# Altium schematic sheet BAT_LFK280k.SchDoc
size A2; SheetNumber: 2; SheetTotal: 2
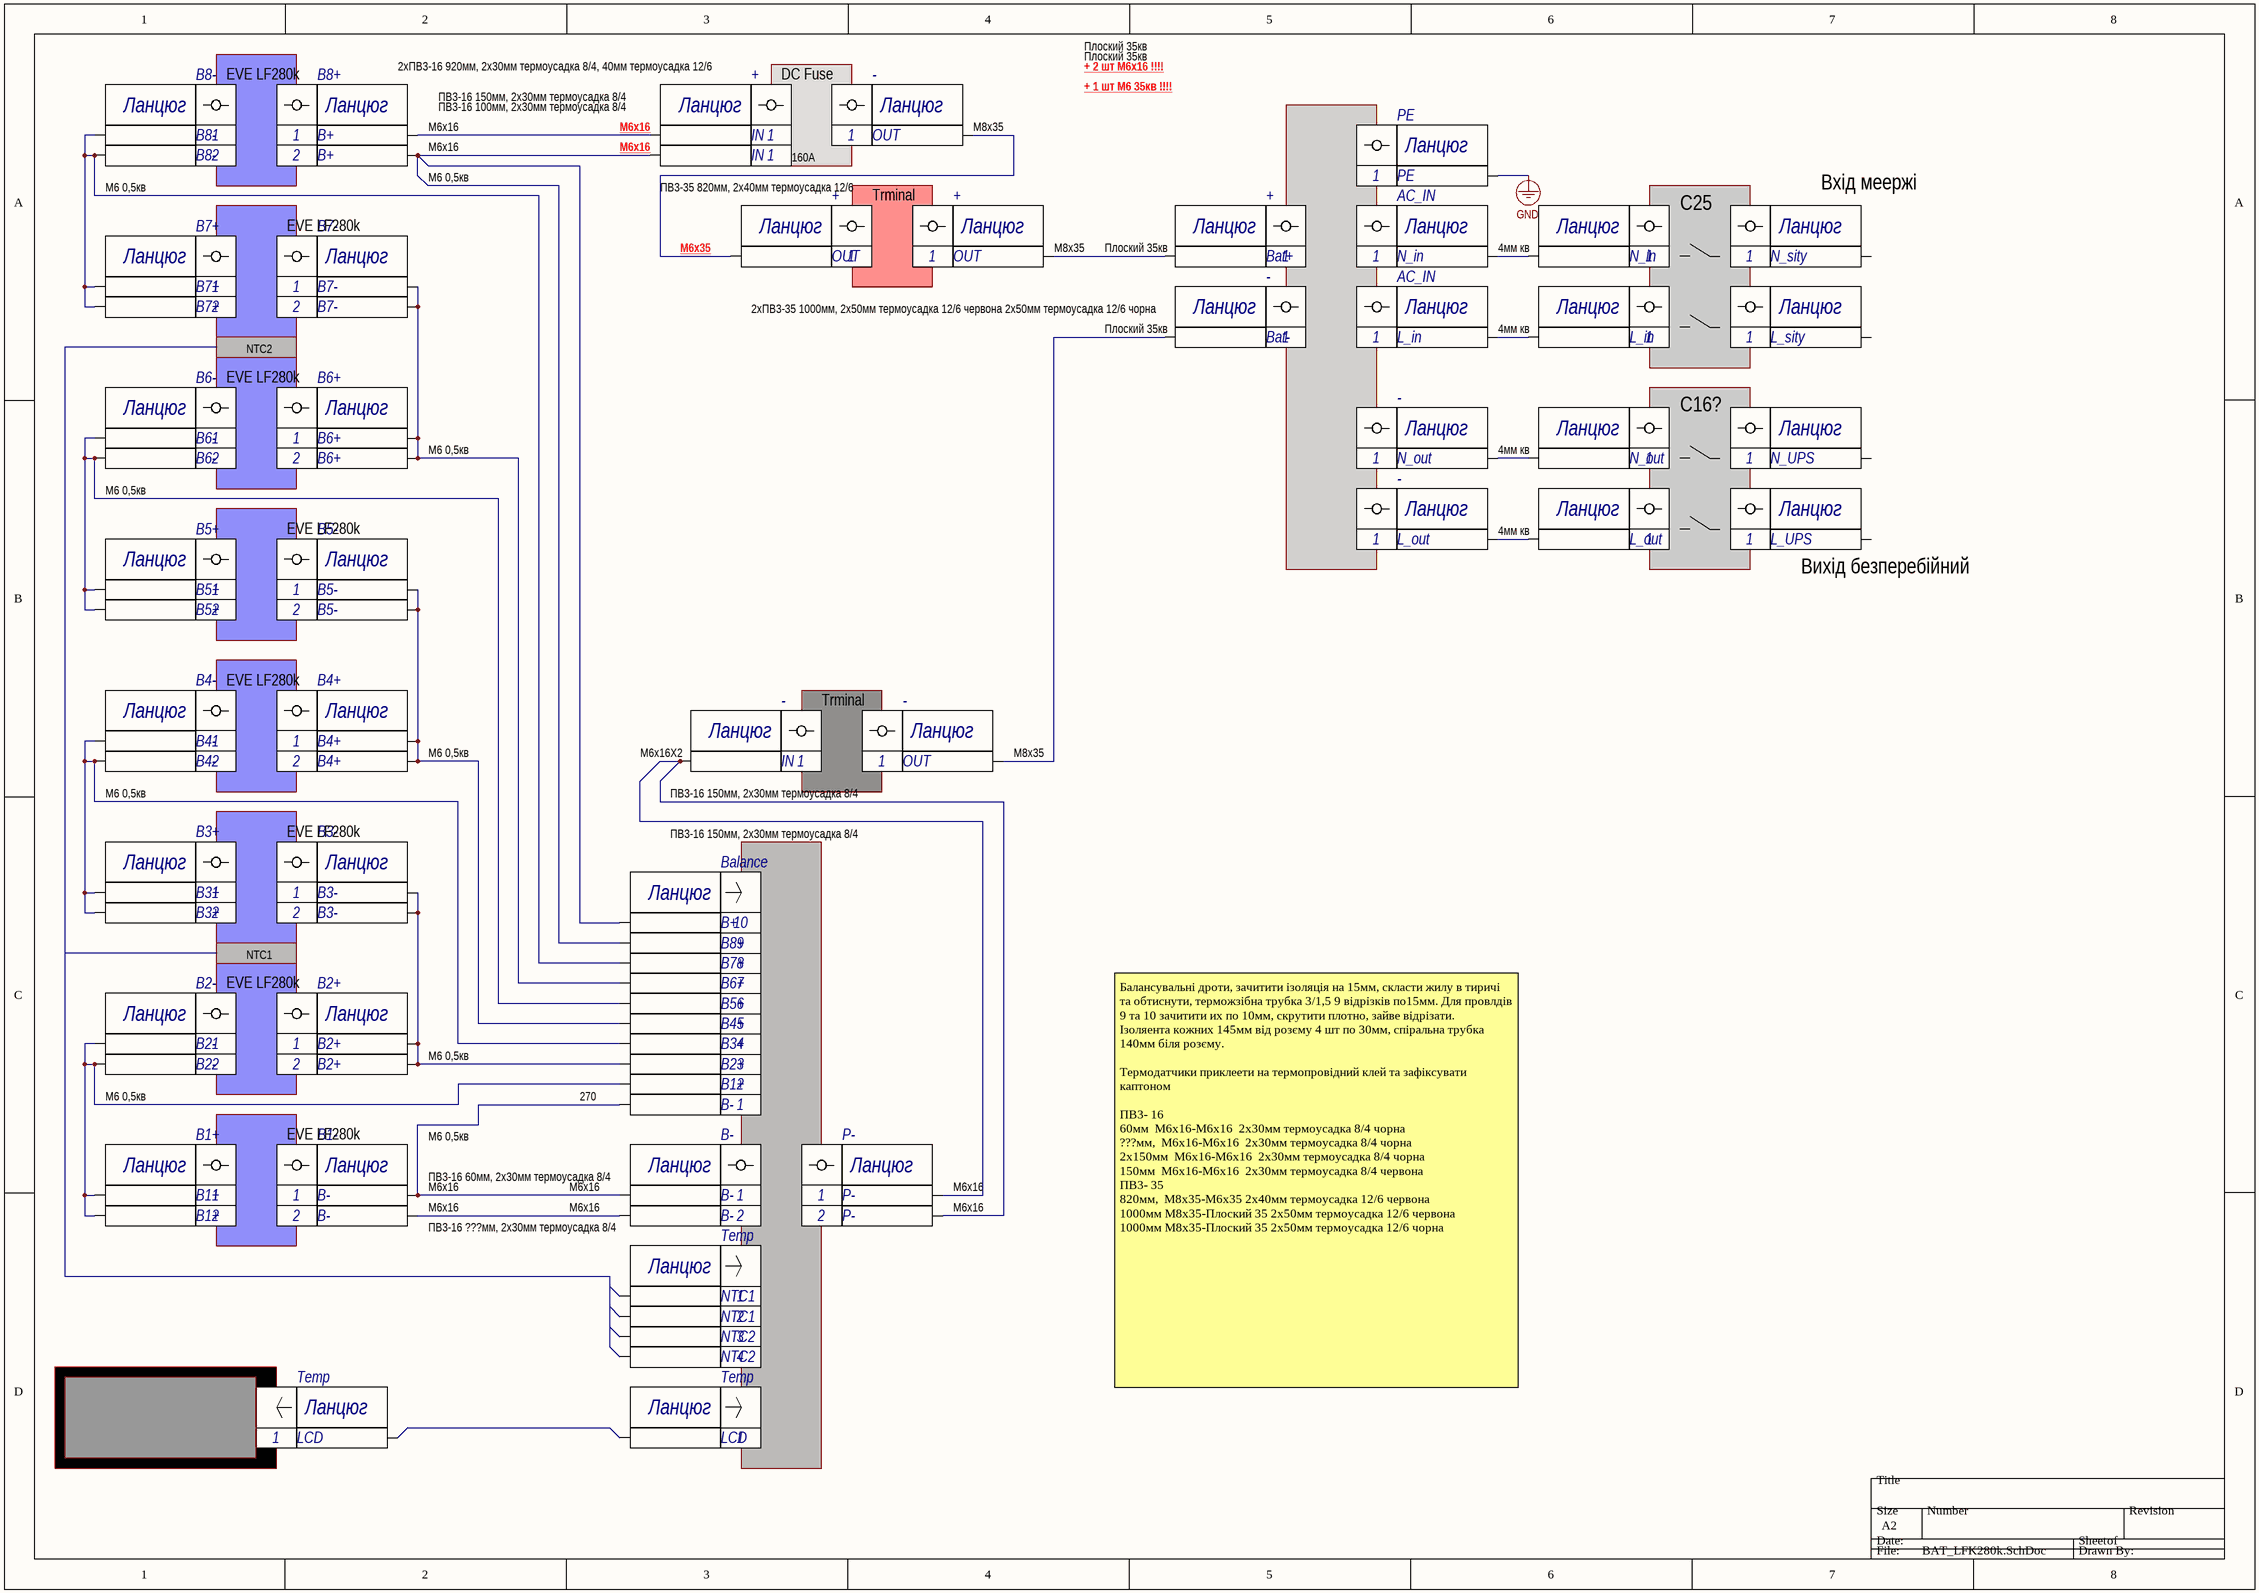
[diagram p0: BAT_LFK280k.SchDoc]

## Parts
(Parts that share a designator on the sheet are numbered #1, #2 ... from top to bottom, then left to right.)
SA?#1  219-2LPS  [219-2LPS]  (value not drawn)  (part A of 2)
SA?#2  219-2LPS  [219-2LPS]  (value not drawn)  (part B of 2)
SA?#3  219-2LPS  [219-2LPS]  (value not drawn)  (part A of 2)
SA?#4  219-2LPS  [219-2LPS]  (value not drawn)  (part B of 2)
ZP?#1  Розєм гвинт Шапка Е4  (value not drawn)
ZP?#2  Розєм гвинт Шапка Е4  (value not drawn)
ZP?#3  Розєм гвинт Шапка Е4  (value not drawn)
ZP?#4  Розєм гвинт Шапка Е4  (value not drawn)
ZP?#5  Розєм Контакт Е4  (value not drawn)
ZP?#6  Розєм Контакт Е4  (value not drawn)
ZP?#7  Розєм Контакт Е4  (value not drawn)
ZP?#8  Розєм Контакт Е4  (value not drawn)
ZP?#9  Розєм Контакт Е4  (value not drawn)
ZP?#10  Розєм Контакт Е4  (value not drawn)
ZP?#11  Розєм Контакт Е4  (value not drawn)
ZP?#12  Розєм гвинт Шапка Е4  (value not drawn)
ZP?#13  Розєм Контакт Е4  (value not drawn)
ZP?#14  Розєм гвинт Шапка Е4  (value not drawn)
ZP?#15  Розєм гвинт Шапка Е4  (value not drawn)
ZP?#16  Розєм гвинт Шапка Е4  (value not drawn)
ZP?#17  Розєм гвинт Шапка Е4  (value not drawn)
ZP?#18  Розєм гвинт Шапка Е4  (value not drawn)
ZP?#19  Розєм гвинт Шапка Е4  (value not drawn)
ZP?#20  Розєм Контакт Е4  (value not drawn)
ZP?#21  Розєм Контакт Е4  (value not drawn)
ZP?#22  Розєм Контакт Е4  (value not drawn)
ZP?#23  Розєм Контакт Е4  (value not drawn)
ZP?#24  Розєм Контакт Е4  (value not drawn)
ZP?#25  Розєм Контакт Е4  (value not drawn)
ZP?#26  Розєм гвинт Шапка Е4  (value not drawn)
ZP?#27  Розєм гвинт Шапка Е4  (value not drawn)
ZP?#28  Розєм Контакт Е4  (value not drawn)
ZP?#29  Розєм Контакт Е4  (value not drawn)
ZP?#30  Розєм Контакт Е4  (value not drawn)
ZP?#31  Розєм Контакт Е4  (value not drawn)
ZP?#32  Розєм гвинт Шапка Е4  (value not drawn)
ZP?#33  Розєм гвинт Шапка Е4  (value not drawn)
ZP?#34  Розєм гвинт Шапка Е4  (value not drawn)
ZP?#35  Розєм гвинт Шапка Е4  (value not drawn)
ZP?#36  Розєм Контакт Е4  (value not drawn)
ZP?#37  Розєм Контакт Е4  (value not drawn)
ZP?#38  Розєм Контакт Е4  (value not drawn)
ZP?#39  Розєм Контакт Е4  (value not drawn)
ZP?#40  Розєм гвинт Шапка Е4  (value not drawn)
ZP?#41  Розєм гвинт Шапка Е4  (value not drawn)
ZP?#42  Розєм Контакт Е4  (value not drawn)
ZP?#43  Розєм Контакт Е4  (value not drawn)
ZP?#44  Розєм гвинт Шапка Е4  (value not drawn)
ZP?#45  Розєм гвинт Шапка Е4  (value not drawn)
ZP?#46  Розєм гвинт Шапка Е4  (value not drawn)
ZP?#47  Розєм Контакт Е4  (value not drawn)
ZP?#48  Розєм Контакт Е4  (value not drawn)
ZP?#49  Розєм Контакт Е4  (value not drawn)
ZP?#50  Розєм Контакт Е4  (value not drawn)
ZP?#51  Розєм Контакт Е4  (value not drawn)
ZP?#52  Розєм гвинт Шапка Е4  (value not drawn)
ZP?#53  Розєм гвинт Шапка Е4  (value not drawn)
ZP?#54  Розєм гвинт Шапка Е4  (value not drawn)
ZP?#55  Розєм Контакт Е4  (value not drawn)
ZP?#56  Розєм Контакт Е4  (value not drawn)
ZP?#57  Розєм Контакт Е4  (value not drawn)
ZP?#58  Розєм гвинт Шапка Е4  (value not drawn)
ZP?#59  Розєм гвинт Шапка Е4  (value not drawn)
ZP?#60  Розєм Контакт Е4  (value not drawn)
ZP?#61  Розєм Контакт Е4  (value not drawn)
ZP?#62  Розєм Контакт Е4  (value not drawn)
ZP?#63  Розєм Контакт Е4  (value not drawn)
ZP?#64  Розєм гвинт Шапка Е4  (value not drawn)
ZP?#65  Розєм гвинт Шапка Е4  (value not drawn)
ZP?#66  Розєм Контакт Е4  (value not drawn)
ZP?#67  Розєм Контакт Е4  (value not drawn)
ZP?#68  Розєм гвинт Шапка Е4  (value not drawn)
ZP?#69  Розєм гвинт Шапка Е4  (value not drawn)
ZP?#70  Розєм Контакт Е4  (value not drawn)
ZP?#71  Розєм Контакт Е4  (value not drawn)
ZP?#72  Розєм Контакт Е4  (value not drawn)
ZP?#73  Розєм Контакт Е4  (value not drawn)
ZP?#74  Розєм гвинт Шапка Е4  (value not drawn)
ZP?#75  Розєм гвинт Шапка Е4  (value not drawn)
ZP?#76  Розєм Контакт Е4  (value not drawn)
ZP?#77  Розєм Контакт Е4  (value not drawn)
ZP?#78  Розєм папа Шапка Е4  (value not drawn)
ZP?#79  Розєм Контакт Е4  (value not drawn)
ZP?#80  Розєм Контакт Е4  (value not drawn)
ZP?#81  Розєм Контакт Е4  (value not drawn)
ZP?#82  Розєм Контакт Е4  (value not drawn)
ZP?#83  Розєм Контакт Е4  (value not drawn)
ZP?#84  Розєм Контакт Е4  (value not drawn)
ZP?#85  Розєм Контакт Е4  (value not drawn)
ZP?#86  Розєм гвинт Шапка Е4  (value not drawn)
ZP?#87  Розєм гвинт Шапка Е4  (value not drawn)
ZP?#88  Розєм Контакт Е4  (value not drawn)
ZP?#89  Розєм Контакт Е4  (value not drawn)
ZP?#90  Розєм Контакт Е4  (value not drawn)
ZP?#91  Розєм Контакт Е4  (value not drawn)
ZP?#92  Розєм Контакт Е4  (value not drawn)
ZP?#93  Розєм Контакт Е4  (value not drawn)
ZP?#94  Розєм Контакт Е4  (value not drawn)
ZP?#95  Розєм Контакт Е4  (value not drawn)
ZP?#96  Розєм Контакт Е4  (value not drawn)
ZP?#97  Розєм гвинт Шапка Е4  (value not drawn)
ZP?#98  Розєм гвинт Шапка Е4  (value not drawn)
ZP?#99  Розєм гвинт Шапка Е4  (value not drawn)
ZP?#100  Розєм гвинт Шапка Е4  (value not drawn)
ZP?#101  Розєм Контакт Е4  (value not drawn)
ZP?#102  Розєм Контакт Е4  (value not drawn)
ZP?#103  Розєм Контакт Е4  (value not drawn)
ZP?#104  Розєм Контакт Е4  (value not drawn)
ZP?#105  Розєм Контакт Е4  (value not drawn)
ZP?#106  Розєм Контакт Е4  (value not drawn)
ZP?#107  Розєм Контакт Е4  (value not drawn)
ZP?#108  Розєм Контакт Е4  (value not drawn)
ZP?#109  Розєм папа Шапка Е4  (value not drawn)
ZP?#110  Розєм Контакт Е4  (value not drawn)
ZP?#111  Розєм Контакт Е4  (value not drawn)
ZP?#112  Розєм Контакт Е4  (value not drawn)
ZP?#113  Розєм Контакт Е4  (value not drawn)
ZP?#114  Розєм папа Шапка Е4  (value not drawn)
ZP?#115  Розєм папа Шапка Е4  (value not drawn)
ZP?#116  Розєм Контакт Е4  (value not drawn)
ZP?#117  Розєм Контакт Е4  (value not drawn)

## Blocks framed on the sheet
EVE LF280k: ZP?#1 ZP?#2
DC Fuse: ZP?#3 ZP?#4
Trminal: ZP?#14 ZP?#15
C25: SA?#1 SA?#2 ZP?#18 ZP?#19 ZP?#34 ZP?#35
EVE LF280k: ZP?#26 ZP?#27
EVE LF280k: ZP?#40 ZP?#41
C16?: SA?#3 SA?#4 ZP?#45 ZP?#46 ZP?#53 ZP?#54
EVE LF280k: ZP?#58 ZP?#59
EVE LF280k: ZP?#64 ZP?#65
Trminal: ZP?#68 ZP?#69
EVE LF280k: ZP?#74 ZP?#75
EVE LF280k: ZP?#86 ZP?#87
EVE LF280k: ZP?#97 ZP?#98

## Nets
GND: ZP?#13.1
NetZP?#5_1: ZP?#5.1 ZP?#9.1 ZP?#28.1 ZP?#30.1 ZP?#83.1
NetZP?#6_1: ZP?#6.1 ZP?#7.1
NetZP?#8_1: ZP?#8.1 ZP?#20.1
NetZP?#10_1: ZP?#10.1 ZP?#11.1 ZP?#81.1 ZP?#82.1
NetZP?#21_1: ZP?#21.1 ZP?#22.1
NetZP?#23_1: ZP?#23.1 ZP?#24.1
NetZP?#29_1: ZP?#29.1 ZP?#31.1 ZP?#43.1 ZP?#48.1 ZP?#84.1
NetZP?#36_1: ZP?#36.1 ZP?#73.1
NetZP?#37_1: ZP?#37.1 ZP?#38.1
NetZP?#42_1: ZP?#42.1 ZP?#47.1 ZP?#60.1 ZP?#62.1 ZP?#85.1
NetZP?#49_1: ZP?#49.1 ZP?#50.1
NetZP?#55_1: ZP?#55.1 ZP?#56.1
NetZP?#61_1: ZP?#61.1 ZP?#63.1 ZP?#67.1 ZP?#71.1 ZP?#88.1
NetZP?#66_1: ZP?#66.1 ZP?#70.1 ZP?#76.1 ZP?#79.1 ZP?#91.1
NetZP?#72_1: ZP?#72.1 ZP?#104.1 ZP?#108.1
NetZP?#77_1: ZP?#77.1 ZP?#80.1 ZP?#90.1 ZP?#93.1 ZP?#94.1
NetZP?#89_1: ZP?#89.1 ZP?#92.1 ZP?#95.1 ZP?#101.1 ZP?#105.1
NetZP?#96_1: ZP?#96.1 ZP?#102.1 ZP?#103.1
NetZP?#106_1: ZP?#106.1 ZP?#107.1

Not connected (* = marked no-connect by the designer): SA?#1 1 2; SA?#2 3 4; SA?#3 1 2; SA?#4 3 4; ZP?#25 1; ZP?#39 1; ZP?#51 1; ZP?#57 1; ZP?#110 1; ZP?#111 1; ZP?#112 1; ZP?#113 1; ZP?#116 1; ZP?#117 1

## Notes on the sheet
- 2хПВ3-16 920мм, 2х30мм термоусадка 8/4, 40мм термоусадка 12/6
- Плоский 35кв
- + 2 шт М6х16 !!!!
- + 1 шт М6 35кв !!!!
- (near ZP?#6) М6х16
- (near ZP?#7) ПВ3-16 100мм, 2х30мм термоусадка 8/4
- (near ZP?#7) ПВ3-16 150мм, 2х30мм термоусадка 8/4
- (near ZP?#7) М6х16
- (near ZP?#8) М8х35
- (near ZP?#9) М6 0,5кв
- (near ZP?#10) М6х16
- (near ZP?#10) М6 0,5кв
- (near ZP?#11) М6х16
- (near ZP?#11) ПВ3-35 820мм, 2х40мм термоусадка 12/6
- (near ZP?#3) 160A
- Вхід меержі
- (near ZP?#20) М6х35
- (near ZP?#21) М8х35
- (near ZP?#22) Плоский 35кв
- (near ZP?#24) 4мм кв
- (near ZP?#36) 2хПВ3-35 1000мм, 2х50мм термоусадка 12/6 червона 2х50мм термоусадка 12/6 чорна
- (near ZP?#36) Плоский 35кв
- (near ZP?#38) 4мм кв
- NTC2
- (near ZP?#47) М6 0,5кв
- (near ZP?#48) М6 0,5кв
- (near ZP?#50) 4мм кв
- (near ZP?#56) 4мм кв
- (near ZP?#57) Вихід безперебійний
- (near ZP?#70) М6 0,5кв
- (near ZP?#71) М6 0,5кв
- (near ZP?#72) М6х16Х2
- (near ZP?#72) ПВ3-16 150мм, 2х30мм термоусадка 8/4
- (near ZP?#73) М8х35
- ПВ3-16 150мм, 2х30мм термоусадка 8/4
- NTC1
- (near ZP?#92) М6 0,5кв
- (near ZP?#93) М6 0,5кв
- (near ZP?#96) 270
- М6 0,5кв
- (near ZP?#102) М6х16
- (near ZP?#103) ПВ3-16 60мм, 2х30мм термоусадка 8/4
- (near ZP?#103) М6х16
- (near ZP?#104) М6х16
- (near ZP?#106) М6х16
- (near ZP?#107) ПВ3-16 ???мм, 2х30мм термоусадка 8/4
- (near ZP?#107) М6х16
- (near ZP?#108) М6х16
- Балансувальні дроти, зачитити ізоляція на 15мм, скласти жилу в тиричі та обтиснути, терможзібна трубка 3/1,5 9 відрізків по15мм. Для провлдів 9 та 10 зачитити их по 10мм, скрутити плотно, зайве відрізати.
  Ізоляента кожних 145мм від розєму 4 шт по 30мм, спіральна трубка 140мм біля розєму.
  Термодатчики приклеети на термопровідний клей та зафіксувати каптоном
  ПВ3- 16
  60мм 	М6х16-М6х16 	2х30мм термоусадка 8/4 чорна
  ???мм, 	М6х16-М6х16 	2х30мм термоусадка 8/4 чорна
  2х150мм 	М6х16-М6х16 	2х30мм термоусадка 8/4 чорна
  150мм 	М6х16-М6х16 	2х30мм термоусадка 8/4 червона
  ПВ3- 35
  820мм, 	М8х35-М6х35	2х40мм термоусадка 12/6 червона
  1000мм	М8х35-Плоский 35	2х50мм термоусадка 12/6 червона
  1000мм	М8х35-Плоский 35	2х50мм термоусадка 12/6 чорна
- (in symbol Розєм гвинт Шапка Е4) Ланцюг
- (in symbol Розєм папа Шапка Е4) Ланцюг

## Library data of the parts
SA?#1-SA?#4 = 219-2LPS: Dip Switch SPST 2 Position Surface Mount Slide (Standard) Actuator 100mA 20VDC; Назва за КД: Перемикач 219-2LPS; Supplier link 1: https://www.digikey.com/en/products/detail/cts-electrocomponents/219-2LPST/223163; Supplier link 2: https://eu.mouser.com/ProductDetail/CTS-Electronic-Components/219-2LPST?qs=qNzHFtQhdJ96rtXqLWSQzw%3D%3D
ZP?#1 = Розєм гвинт Шапка Е4: Номер джута для схеми Е4 , сам номер вписувати в параметр Номер; Parameter Designator: B8-
ZP?#2 = Розєм гвинт Шапка Е4: Номер джута для схеми Е4 , сам номер вписувати в параметр Номер; Parameter Designator: B8+
ZP?#3 ZP?#14-ZP?#16 = Розєм гвинт Шапка Е4: Номер джута для схеми Е4 , сам номер вписувати в параметр Номер; Parameter Designator: +
ZP?#4 ZP?#18 ZP?#19 ZP?#32 ZP?#34 ZP?#35 ZP?#44-ZP?#46 ZP?#52-ZP?#54 ZP?#68 ZP?#69 = Розєм гвинт Шапка Е4: Номер джута для схеми Е4 , сам номер вписувати в параметр Номер
  ZP?#4 ZP?#32 ZP?#44 ZP?#52 ZP?#68 ZP?#69: Parameter Designator: -
ZP?#5 ZP?#9 = Розєм Контакт Е4: Номер джута для схеми Е4 , сам номер вписувати в параметр Номер; Parameter 1: B8-; Parameter Designator: *
  ZP?#5: Pin: 1
  ZP?#9: Pin: 2
ZP?#6 ZP?#10 ZP?#81 = Розєм Контакт Е4: Номер джута для схеми Е4 , сам номер вписувати в параметр Номер; Parameter 1: B+; Parameter Designator: *
  ZP?#6: Pin: 1
  ZP?#10: Pin: 2
  ZP?#81: Pin: 10
ZP?#7 ZP?#11 ZP?#72 = Розєм Контакт Е4: Номер джута для схеми Е4 , сам номер вписувати в параметр Номер; Parameter 1: IN; Parameter Designator: *; Pin: 1
ZP?#8 ZP?#20 ZP?#21 ZP?#73 = Розєм Контакт Е4: Номер джута для схеми Е4 , сам номер вписувати в параметр Номер; Parameter 1: OUT; Parameter Designator: *; Pin: 1
ZP?#12 = Розєм гвинт Шапка Е4: Номер джута для схеми Е4 , сам номер вписувати в параметр Номер; Parameter Designator: PE
ZP?#13 = Розєм Контакт Е4: Номер джута для схеми Е4 , сам номер вписувати в параметр Номер; Parameter 1: PE; Parameter Designator: *; Pin: 1
ZP?#17 ZP?#33 = Розєм гвинт Шапка Е4: Номер джута для схеми Е4 , сам номер вписувати в параметр Номер; Parameter Designator: AC_IN
ZP?#22 = Розєм Контакт Е4: Номер джута для схеми Е4 , сам номер вписувати в параметр Номер; Parameter 1: Bat+; Parameter Designator: *; Pin: 1
ZP?#23 ZP?#24 = Розєм Контакт Е4: Номер джута для схеми Е4 , сам номер вписувати в параметр Номер; Parameter 1: N_in; Parameter Designator: *; Pin: 1
ZP?#25 = Розєм Контакт Е4: Номер джута для схеми Е4 , сам номер вписувати в параметр Номер; Parameter 1: N_sity; Parameter Designator: *; Pin: 1
ZP?#26 = Розєм гвинт Шапка Е4: Номер джута для схеми Е4 , сам номер вписувати в параметр Номер; Parameter Designator: B7+
ZP?#27 = Розєм гвинт Шапка Е4: Номер джута для схеми Е4 , сам номер вписувати в параметр Номер; Parameter Designator: B7-
ZP?#28 ZP?#30 ZP?#83 = Розєм Контакт Е4: Номер джута для схеми Е4 , сам номер вписувати в параметр Номер; Parameter 1: B7+; Parameter Designator: *
  ZP?#28: Pin: 1
  ZP?#30: Pin: 2
  ZP?#83: Pin: 8
ZP?#29 ZP?#31 = Розєм Контакт Е4: Номер джута для схеми Е4 , сам номер вписувати в параметр Номер; Parameter 1: B7-; Parameter Designator: *
  ZP?#29: Pin: 1
  ZP?#31: Pin: 2
ZP?#36 = Розєм Контакт Е4: Номер джута для схеми Е4 , сам номер вписувати в параметр Номер; Parameter 1: Bat-; Parameter Designator: *; Pin: 1
ZP?#37 ZP?#38 = Розєм Контакт Е4: Номер джута для схеми Е4 , сам номер вписувати в параметр Номер; Parameter 1: L_in; Parameter Designator: *; Pin: 1
ZP?#39 = Розєм Контакт Е4: Номер джута для схеми Е4 , сам номер вписувати в параметр Номер; Parameter 1: L_sity; Parameter Designator: *; Pin: 1
ZP?#40 = Розєм гвинт Шапка Е4: Номер джута для схеми Е4 , сам номер вписувати в параметр Номер; Parameter Designator: B6-
ZP?#41 = Розєм гвинт Шапка Е4: Номер джута для схеми Е4 , сам номер вписувати в параметр Номер; Parameter Designator: B6+
ZP?#42 ZP?#47 = Розєм Контакт Е4: Номер джута для схеми Е4 , сам номер вписувати в параметр Номер; Parameter 1: B6-; Parameter Designator: *
  ZP?#42: Pin: 1
  ZP?#47: Pin: 2
ZP?#43 ZP?#48 ZP?#84 = Розєм Контакт Е4: Номер джута для схеми Е4 , сам номер вписувати в параметр Номер; Parameter 1: B6+; Parameter Designator: *
  ZP?#43: Pin: 1
  ZP?#48: Pin: 2
  ZP?#84: Pin: 7
ZP?#49 ZP?#50 = Розєм Контакт Е4: Номер джута для схеми Е4 , сам номер вписувати в параметр Номер; Parameter 1: N_out; Parameter Designator: *; Pin: 1
ZP?#51 = Розєм Контакт Е4: Номер джута для схеми Е4 , сам номер вписувати в параметр Номер; Parameter 1: N_UPS; Parameter Designator: *; Pin: 1
ZP?#55 ZP?#56 = Розєм Контакт Е4: Номер джута для схеми Е4 , сам номер вписувати в параметр Номер; Parameter 1: L_out; Parameter Designator: *; Pin: 1
ZP?#57 = Розєм Контакт Е4: Номер джута для схеми Е4 , сам номер вписувати в параметр Номер; Parameter 1: L_UPS; Parameter Designator: *; Pin: 1
ZP?#58 = Розєм гвинт Шапка Е4: Номер джута для схеми Е4 , сам номер вписувати в параметр Номер; Parameter Designator: B5+
ZP?#59 = Розєм гвинт Шапка Е4: Номер джута для схеми Е4 , сам номер вписувати в параметр Номер; Parameter Designator: B5-
ZP?#60 ZP?#62 ZP?#85 = Розєм Контакт Е4: Номер джута для схеми Е4 , сам номер вписувати в параметр Номер; Parameter 1: B5+; Parameter Designator: *
  ZP?#60: Pin: 1
  ZP?#62: Pin: 2
  ZP?#85: Pin: 6
ZP?#61 ZP?#63 = Розєм Контакт Е4: Номер джута для схеми Е4 , сам номер вписувати в параметр Номер; Parameter 1: B5-; Parameter Designator: *
  ZP?#61: Pin: 1
  ZP?#63: Pin: 2
ZP?#64 = Розєм гвинт Шапка Е4: Номер джута для схеми Е4 , сам номер вписувати в параметр Номер; Parameter Designator: B4-
ZP?#65 = Розєм гвинт Шапка Е4: Номер джута для схеми Е4 , сам номер вписувати в параметр Номер; Parameter Designator: B4+
ZP?#66 ZP?#70 = Розєм Контакт Е4: Номер джута для схеми Е4 , сам номер вписувати в параметр Номер; Parameter 1: B4-; Parameter Designator: *
  ZP?#66: Pin: 1
  ZP?#70: Pin: 2
ZP?#67 ZP?#71 ZP?#88 = Розєм Контакт Е4: Номер джута для схеми Е4 , сам номер вписувати в параметр Номер; Parameter 1: B4+; Parameter Designator: *
  ZP?#67: Pin: 1
  ZP?#71: Pin: 2
  ZP?#88: Pin: 5
ZP?#74 = Розєм гвинт Шапка Е4: Номер джута для схеми Е4 , сам номер вписувати в параметр Номер; Parameter Designator: B3+
ZP?#75 = Розєм гвинт Шапка Е4: Номер джута для схеми Е4 , сам номер вписувати в параметр Номер; Parameter Designator: B3-
ZP?#76 ZP?#79 ZP?#91 = Розєм Контакт Е4: Номер джута для схеми Е4 , сам номер вписувати в параметр Номер; Parameter 1: B3+; Parameter Designator: *
  ZP?#76: Pin: 1
  ZP?#79: Pin: 2
  ZP?#91: Pin: 4
ZP?#77 ZP?#80 = Розєм Контакт Е4: Номер джута для схеми Е4 , сам номер вписувати в параметр Номер; Parameter 1: B3-; Parameter Designator: *
  ZP?#77: Pin: 1
  ZP?#80: Pin: 2
ZP?#78 = Розєм папа Шапка Е4: Номер джута для схеми Е4 , сам номер вписувати в параметр Номер; Parameter Designator: Balance
ZP?#82 = Розєм Контакт Е4: Номер джута для схеми Е4 , сам номер вписувати в параметр Номер; Parameter 1: B8+; Parameter Designator: *; Pin: 9
ZP?#86 = Розєм гвинт Шапка Е4: Номер джута для схеми Е4 , сам номер вписувати в параметр Номер; Parameter Designator: B2-
ZP?#87 = Розєм гвинт Шапка Е4: Номер джута для схеми Е4 , сам номер вписувати в параметр Номер; Parameter Designator: B2+
ZP?#89 ZP?#92 = Розєм Контакт Е4: Номер джута для схеми Е4 , сам номер вписувати в параметр Номер; Parameter 1: B2-; Parameter Designator: *
  ZP?#89: Pin: 1
  ZP?#92: Pin: 2
ZP?#90 ZP?#93 ZP?#94 = Розєм Контакт Е4: Номер джута для схеми Е4 , сам номер вписувати в параметр Номер; Parameter 1: B2+; Parameter Designator: *
  ZP?#90: Pin: 1
  ZP?#93: Pin: 2
  ZP?#94: Pin: 3
ZP?#95 ZP?#101 ZP?#105 = Розєм Контакт Е4: Номер джута для схеми Е4 , сам номер вписувати в параметр Номер; Parameter 1: B1+; Parameter Designator: *
  ZP?#95 ZP?#105: Pin: 2
  ZP?#101: Pin: 1
ZP?#96 ZP?#102 ZP?#103 ZP?#106 ZP?#107 = Розєм Контакт Е4: Номер джута для схеми Е4 , сам номер вписувати в параметр Номер; Parameter 1: B-; Parameter Designator: *
  ZP?#96 ZP?#102 ZP?#103: Pin: 1
  ZP?#106 ZP?#107: Pin: 2
ZP?#97 = Розєм гвинт Шапка Е4: Номер джута для схеми Е4 , сам номер вписувати в параметр Номер; Parameter Designator: B1+
ZP?#98 = Розєм гвинт Шапка Е4: Номер джута для схеми Е4 , сам номер вписувати в параметр Номер; Parameter Designator: B1-
ZP?#99 = Розєм гвинт Шапка Е4: Номер джута для схеми Е4 , сам номер вписувати в параметр Номер; Parameter Designator: B-
ZP?#100 = Розєм гвинт Шапка Е4: Номер джута для схеми Е4 , сам номер вписувати в параметр Номер; Parameter Designator: P-
ZP?#104 ZP?#108 = Розєм Контакт Е4: Номер джута для схеми Е4 , сам номер вписувати в параметр Номер; Parameter 1: P-; Parameter Designator: *
  ZP?#104: Pin: 1
  ZP?#108: Pin: 2
ZP?#109 ZP?#114 ZP?#115 = Розєм папа Шапка Е4: Номер джута для схеми Е4 , сам номер вписувати в параметр Номер; Parameter Designator: Temp
ZP?#110 ZP?#111 = Розєм Контакт Е4: Номер джута для схеми Е4 , сам номер вписувати в параметр Номер; Parameter 1: NTC1; Parameter Designator: *
  ZP?#110: Pin: 1
  ZP?#111: Pin: 2
ZP?#112 ZP?#113 = Розєм Контакт Е4: Номер джута для схеми Е4 , сам номер вписувати в параметр Номер; Parameter 1: NTC2; Parameter Designator: *
  ZP?#112: Pin: 3
  ZP?#113: Pin: 4
ZP?#116 ZP?#117 = Розєм Контакт Е4: Номер джута для схеми Е4 , сам номер вписувати в параметр Номер; Parameter 1: LCD; Parameter Designator: *; Pin: 1